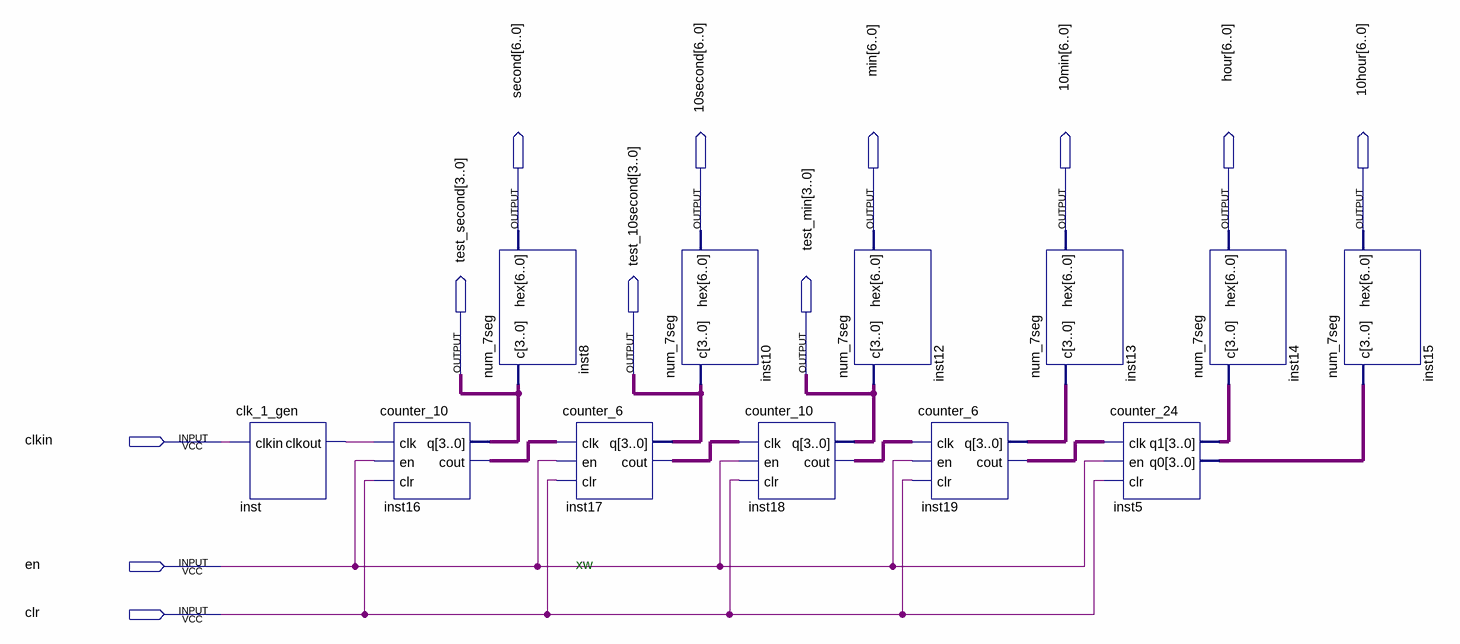
[diagram p0: schematic sheet]
// Quartus schematic clock.bdf as structural Verilog: 12 symbols, 12 pins
module clock (
  input  clkin,
  input  en,
  input  clr,
  output [6:0] second,
  output [6:0] \10second ,
  output [6:0] min,
  output [6:0] \10min ,
  output [6:0] hour,
  output [6:0] \10hour ,
  output [3:0] test_second,
  output [3:0] test_10second,
  output [3:0] test_min
);

  wire inst16_cout, inst17_cout, inst18_cout, inst19_cout, inst_clkout;
  wire [3:0] inst5_q0, inst5_q1, inst19_q;

  clk_1_gen inst (.clkin(clkin), .clkout(inst_clkout));
  counter_10 inst16 (.clk(inst_clkout), .en(en), .clr(clr), .q(test_second), .cout(inst16_cout));
  num_7seg inst8 (.c(test_second), .hex(second));
  counter_6 inst17 (.clk(inst16_cout), .en(en), .clr(clr), .q(test_10second), .cout(inst17_cout));
  num_7seg inst10 (.c(test_10second), .hex(\10second ));
  counter_10 inst18 (.clk(inst17_cout), .en(en), .clr(clr), .q(test_min), .cout(inst18_cout));
  num_7seg inst12 (.c(test_min), .hex(min));
  counter_6 inst19 (.clk(inst18_cout), .en(en), .clr(clr), .q(inst19_q), .cout(inst19_cout));
  num_7seg inst13 (.c(inst19_q), .hex(\10min ));
  counter_24 inst5 (.clk(inst19_cout), .en(en), .clr(clr), .q1(inst5_q1), .q0(inst5_q0));
  num_7seg inst14 (.c(inst5_q1), .hex(hour));
  num_7seg inst15 (.c(inst5_q0), .hex(\10hour ));

  // Notes on the sheet:
  //   xw
endmodule
